# Altium project PCB_Project.PrjPcb
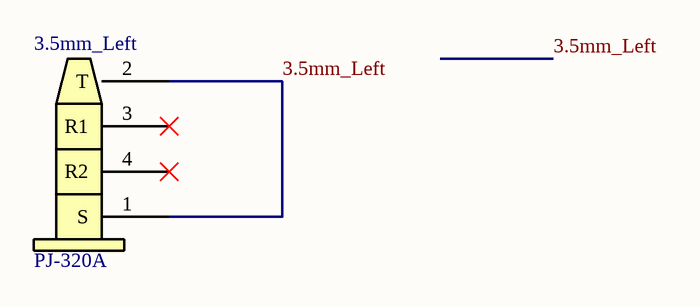
[diagram p0: LeftEar.SchDoc]
2 sheets, 2 parts. Net scope: global (net labels, ports and power ports of the same name join across sheets).
Board files: LeftEar.PcbDoc, RightEar.PcbDoc
Sheets:
  LeftEar.SchDoc
  RightEar.SchDoc

## Sheet LeftEar.SchDoc
size A4; SheetNumber: 1; SheetTotal: 2

### Parts
3.5mm_Left  PJ-320A  [PCBComponent_1]

### Nets
3.5mm_Left: 3.5mm_Left.1(S) 3.5mm_Left.2(T)

Not connected (* = marked no-connect by the designer): 3.5mm_Left 3(R1)* 4(R2)*

### Library data of the parts
3.5mm_Left = PJ-320A: A thru hole 3.5mm TRRS audio jack connector

## Sheet RightEar.SchDoc
size A4; SheetNumber: 2; SheetTotal: 2
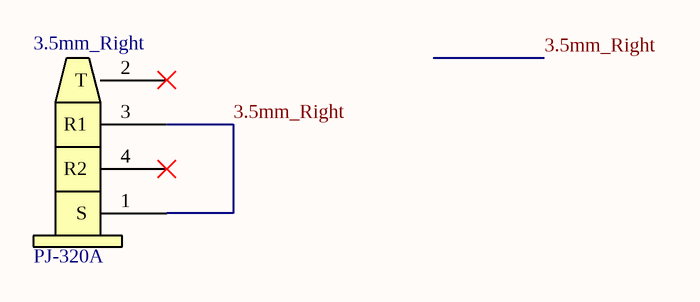
[diagram p1: RightEar.SchDoc]

### Parts
3.5mm_Right  PJ-320A  [PCBComponent_1]

### Nets
3.5mm_Right: 3.5mm_Right.1(S) 3.5mm_Right.3(R1)

Not connected (* = marked no-connect by the designer): 3.5mm_Right 2(T)* 4(R2)*

### Library data of the parts
3.5mm_Right = PJ-320A: as 3.5mm_Left on sheet LeftEar